# Altium schematic sheet PowerSupply.SchDoc: SD Card Power Board
size Tabloid; Date: 05/10/2023; Engineer: Terry D. Schevker; Revision: 1.0; SheetNumber: 2; SheetTotal: 3
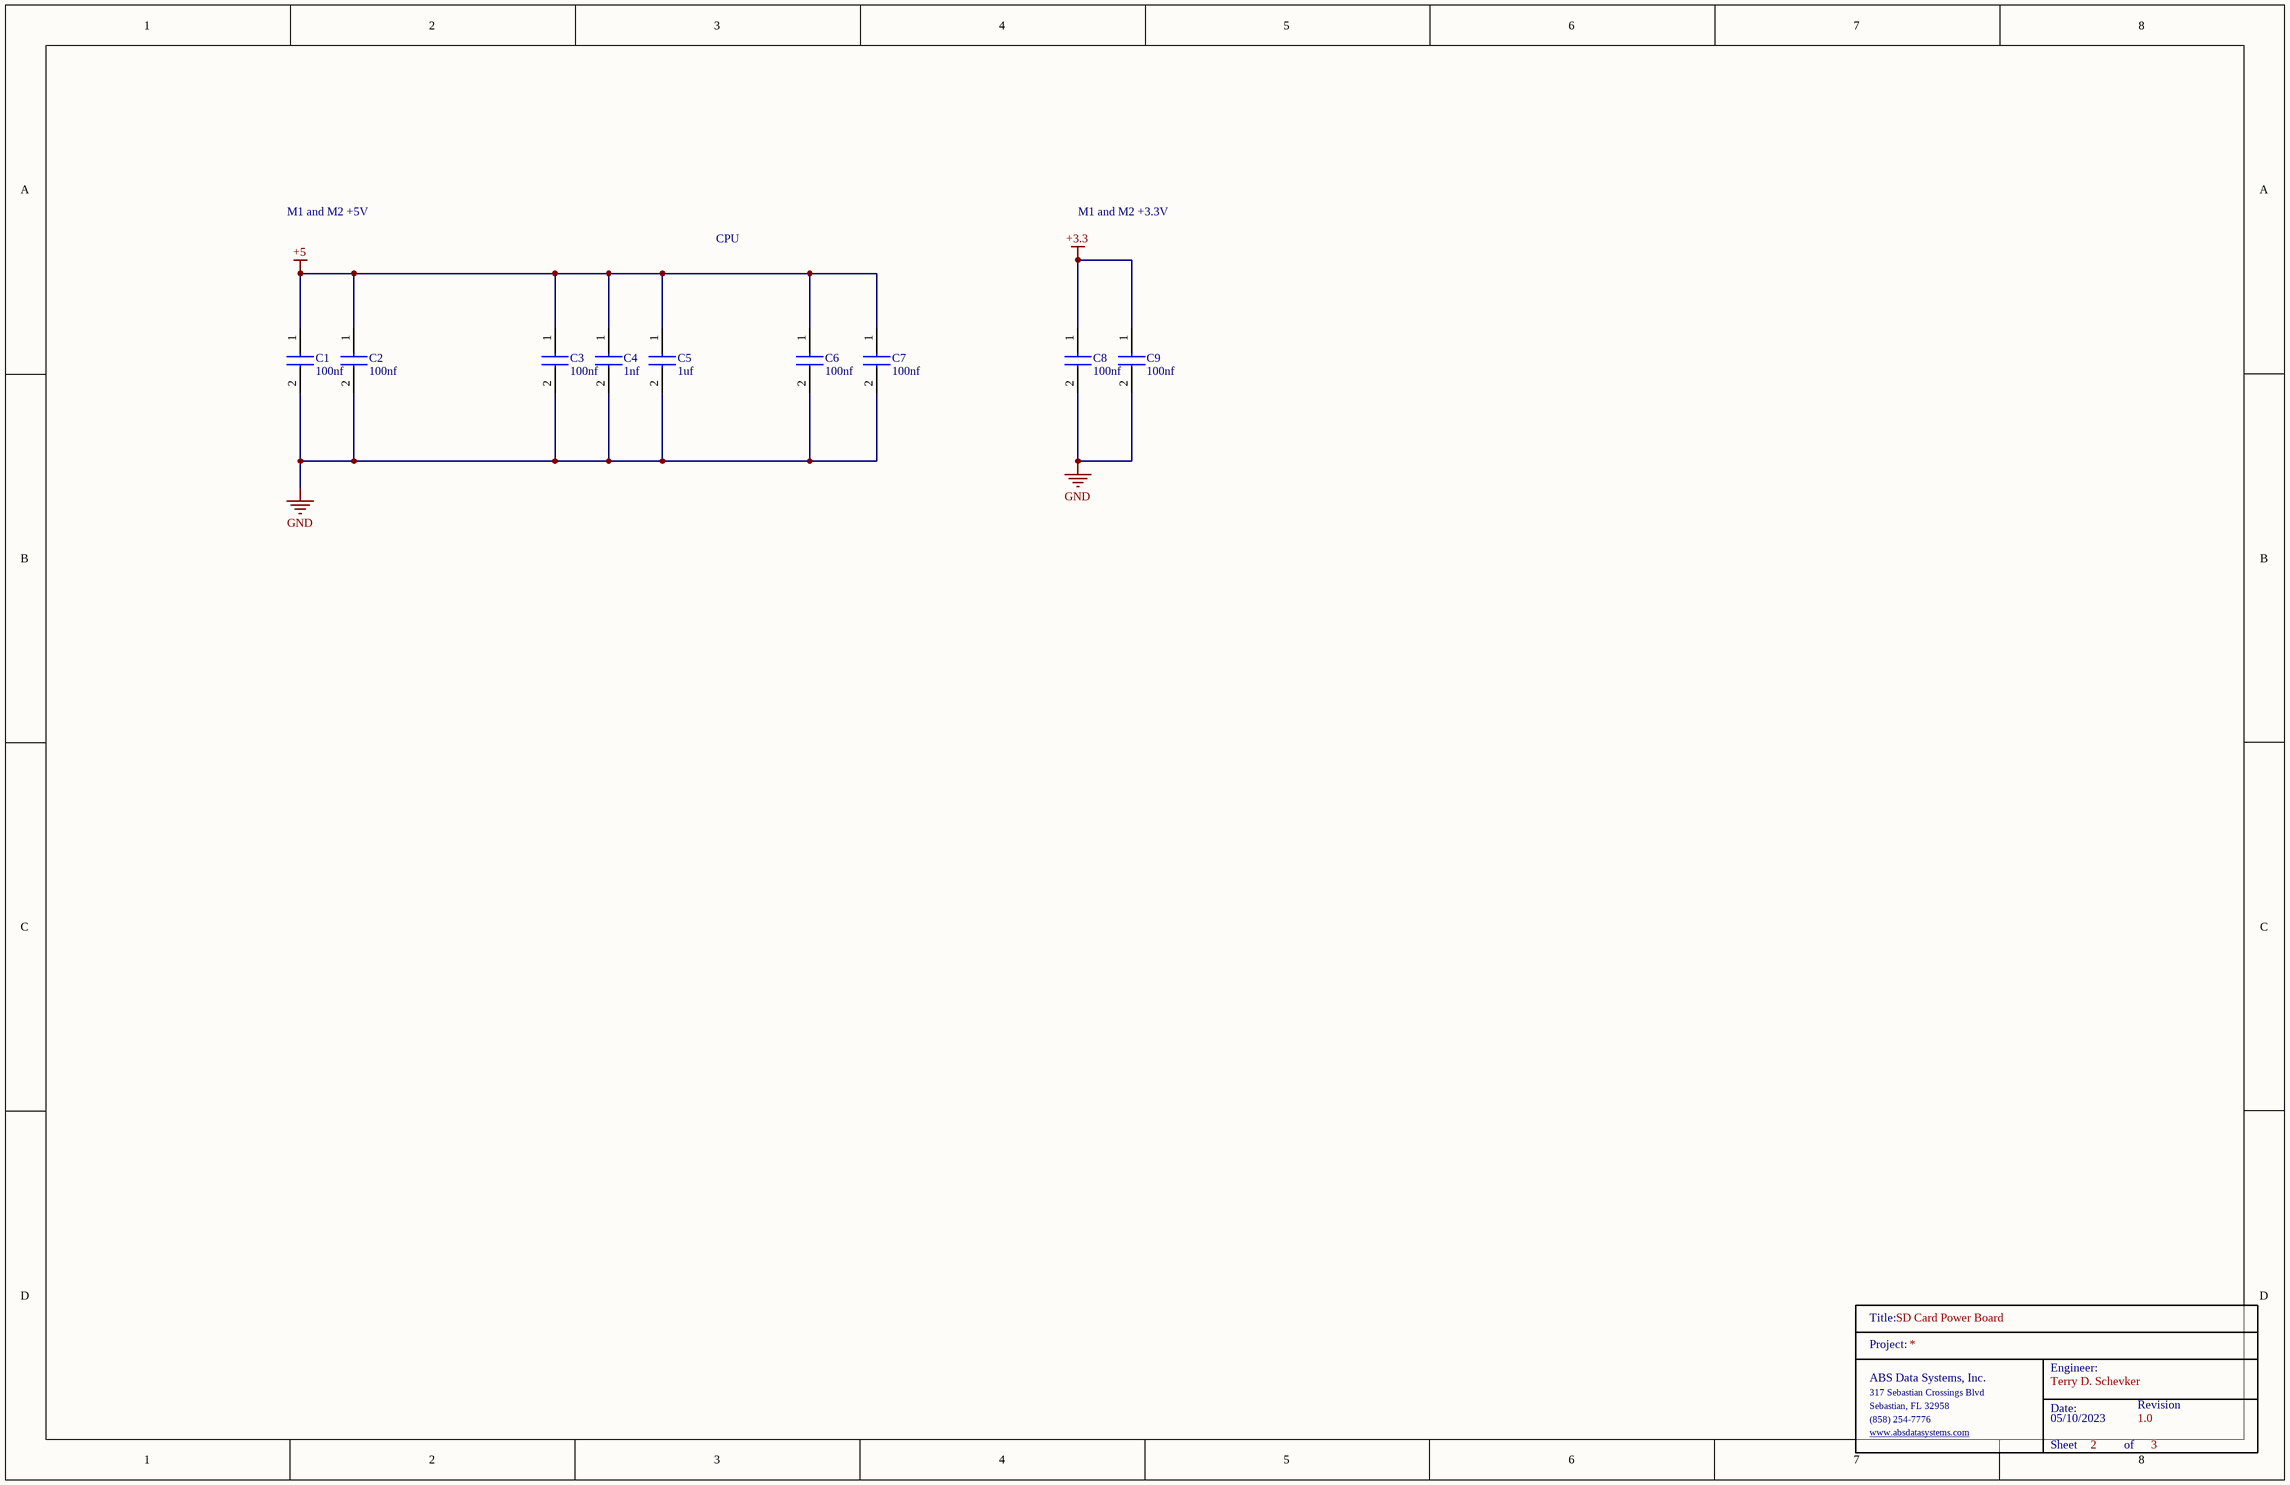
[diagram p0: PowerSupply.SchDoc]

## Parts
C1  100nf  [0603]
C2  100nf  [0603]
C3  100nf  [0603]
C4  1nf  [0603]
C5  1uf  [0603]
C6  100nf  [0603]
C7  100nf  [0603]
C8  100nf  [0603]
C9  100nf  [0603]
TitleBlock_2  TitleBlock  (value not drawn)  (graphical)

## Nets
+3.3: C8.1 C9.1
+5: C1.1 C2.1 C3.1 C4.1 C5.1 C6.1 C7.1
GND: C1.2 C2.2 C3.2 C4.2 C5.2 C6.2 C7.2 C8.2 C9.2

## Notes on the sheet
- M1 and M2 +5V
- M1 and M2 +3.3V
- CPU
- (in symbol TitleBlock) Title:; Project:; Engineer:; ABS Data Systems, Inc.; 317 Sebastian Crossings Blvd; Sebastian, FL 32958; Date:; Revision; (858) 254-7776; www.absdatasystems.com; Sheet; of

## Library data of the parts
C1-C3 C6-C9 = CL10B104JB8NNNC: Samsung Electro-Mechanics 0603 100nf
C4 = CL10B102KB8NNNL: Samsung Electro-Mechanics 0603 1nf
C5 = CL10B105KA8NNNL: Samsung Electro-Mechanics 0603 1uf